# Altium schematic sheet PM3_Bosclone_Shield.SchDoc
size A
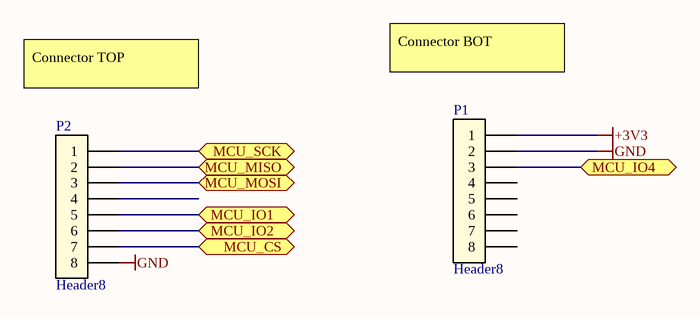
[diagram p0: PM3_Bosclone_Shield.SchDoc]

## Parts
P1  Header8  [HEADER_8_40_100THRU SIP]
P2  Header8  [HEADER_8_40_100THRU SIP]

## Ports
MCU_CS, MCU_IO1, MCU_IO2, MCU_IO4, MCU_MISO, MCU_MOSI, MCU_SCK

## Nets
+3V3: P1.1
GND: P1.2 P2.8
MCU_CS: P2.7 ; port MCU_CS
MCU_IO1: P2.5 ; port MCU_IO1
MCU_IO2: P2.6 ; port MCU_IO2
MCU_IO4: P1.3 ; port MCU_IO4
MCU_MISO: P2.2 ; port MCU_MISO
MCU_MOSI: P2.3 ; port MCU_MOSI
MCU_SCK: P2.1 ; port MCU_SCK

Not connected (* = marked no-connect by the designer): P1 4 5 6 7 8; P2 4

## Notes on the sheet
- Connector TOP
- Connector BOT

## Library data of the parts
P1 P2 = Header8: Header 8 pin